# Altium schematic sheet Sheet2.SchDoc
size A4
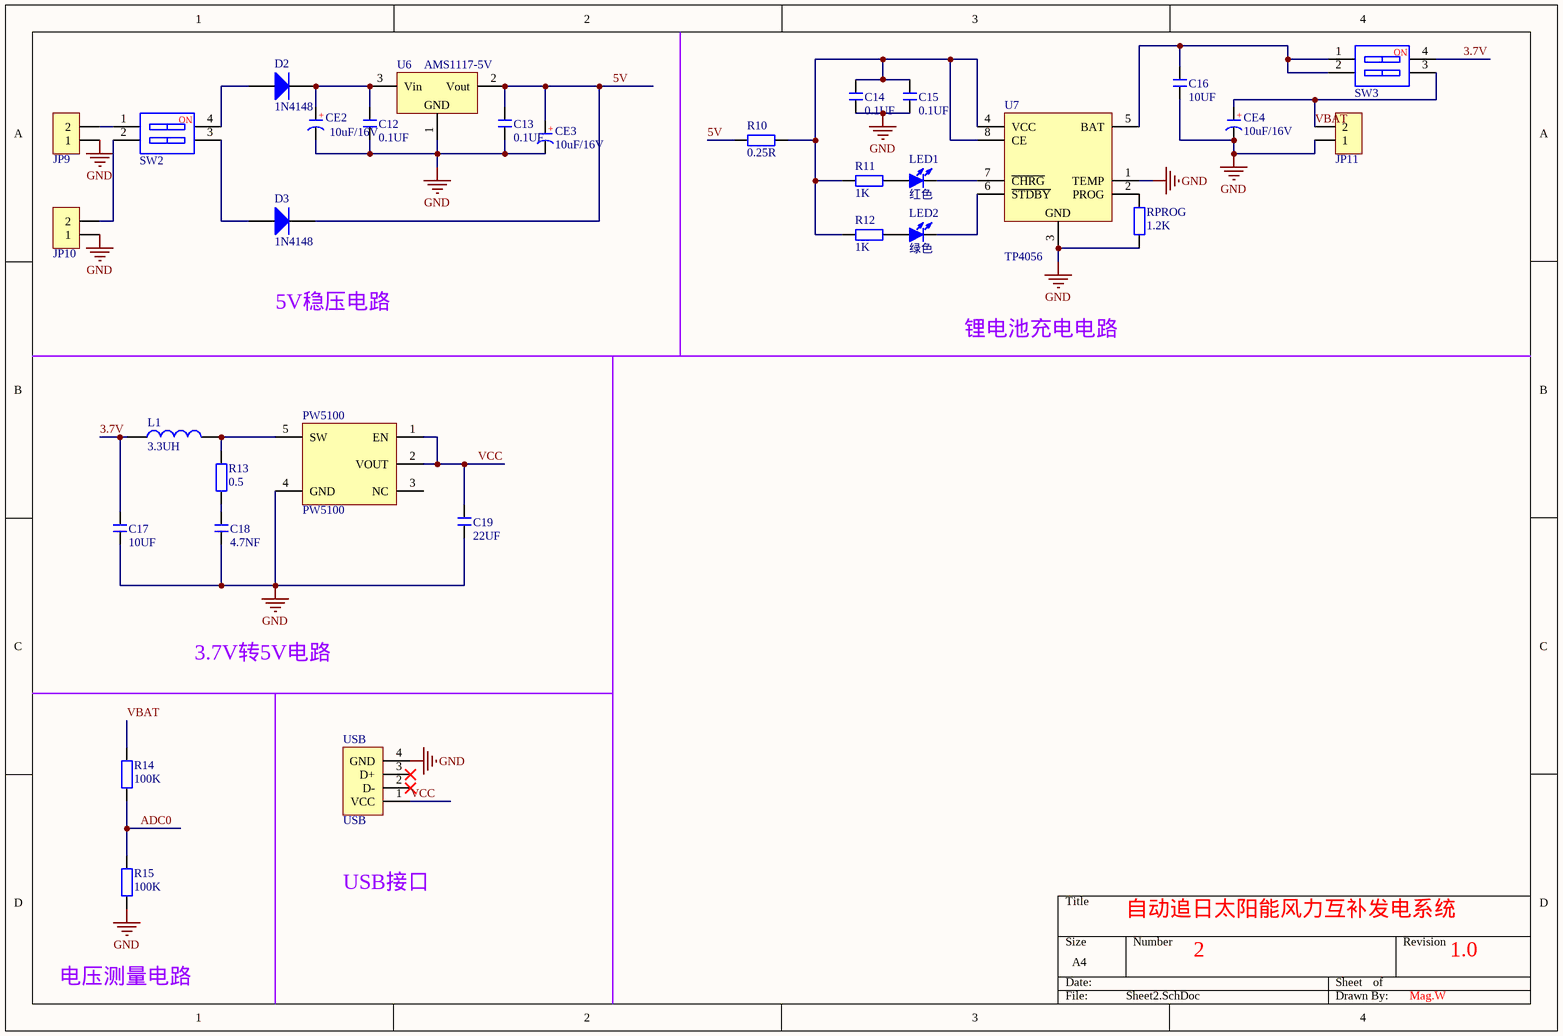
[diagram p0: Sheet2.SchDoc]

## Parts
C12  0.1UF  [C 0805_L]
C13  0.1UF  [C 0805_L]
C14  0.1UF  [C 0805_L]
C15  0.1UF  [C 0805_L]
C16  10UF  [C 0805_L]
C17  10UF  [C 0805_L]
C18  4.7NF  [C 0805_L]
C19  22UF  [C 0805_L]
CE2  10uF/16V  [CAP 1.5*4*8 - BK]
CE3  10uF/16V  [CAP 1.5*4*8 - BK]
CE4  10uF/16V  [CAP 1.5*4*8 - BK]
D2  Type: 1N4148  [DIODE-1206]  (hidden comment: Diode)
D3  Type: 1N4148  [DIODE-1206]  (hidden comment: Diode)
JP9  HDR-1X2  [KF350-2P]  (value not drawn)
JP10  HDR-1X2  [KF350-2P]  (value not drawn)
JP11  HDR-1X2  [XH2.54-WI-2P]  (value not drawn)
L1  3.3UH  [L 0805]
LED1  红色  [LED 0603R]
LED2  绿色  [LED 0603G]
PW5100  PW5100  [PCBComponent_1]
R10  0.25R  [R 0805_L]
R11  1K  [R 0805_L]
R12  1K  [R 0805_L]
R13  0.5  [R 0805_L]
R14  100K  [R 0805_L]
R15  100K  [R 0805_L]
RPROG  1.2K  [R 0805_L]
SW2  SW-2P  [CSW DIP-2P]  (value not drawn)
SW3  SW-2P  [CSW DIP-2P]  (value not drawn)
U6  AMS1117-5V  [SOT223_L]
U7  TP4056  [SO8]
USB  USB  [USB-A/S_A]

## Nets
GND: C12.2 C13.2 C14.1 C15.1 C16.1 C17.1 C18.1 C19.1 CE2.2(K) CE3.2(K) CE4.2(K) JP9.1 JP10.1 JP11.1 PW5100.4(GND) R15.1 RPROG.1 U6.1(GND) U7.1(TEMP) U7.3(GND) USB.4(GND)
3.7V: C17.2 L1.1 SW3.4
5V: C13.1 CE3.1(A) D3.2(K) R10.1 U6.2(Vout)
ADC0: R14.1 R15.2
VBAT: CE4.1(A) JP11.2 R14.2 SW3.3
VCC: C19.2 PW5100.1(EN) PW5100.2(VOUT) USB.1(VCC)
NetC12_1: C12.1 CE2.1(A) D2.2(K) U6.3(Vin)
NetC14_2: C14.2 C15.2 R10.2 R11.1 R12.1 U7.4(VCC) U7.8(CE)
NetC16_2: C16.2 SW3.1 SW3.2 U7.5(BAT)
NetC18_2: C18.2 R13.2
NetD2_1: D2.1(A) SW2.4
NetD3_1: D3.1(A) SW2.3
NetJP9_2: JP9.2 SW2.1
NetJP10_2: JP10.2 SW2.2
NetL1_2: L1.2 PW5100.5(SW) R13.1
NetLED1_1: LED1.1(A) R11.2
NetLED1_2: LED1.2(K) U7.7(~{CHRG})
NetLED2_1: LED2.1(A) R12.2
NetLED2_2: LED2.2(K) U7.6(~{STDBY})
NetRPROG_2: RPROG.2 U7.2(PROG)

Not connected (* = marked no-connect by the designer): PW5100 3(NC); USB 2(D-)* 3(D+)*

## Notes on the sheet
- 5V稳压电路
- 锂电池充电电路
- 3.7V转5V电路
- USB接口
- 自动追日太阳能风力互补发电系统
- 电压测量电路
- 2
- 1.0
- Mag.W
- (in symbol CE) +
- (in symbol SW-2P) NO

## Library data of the parts
C12-C19 = C: 贴片电容; BOM名称: 无极性贴片电容; 淘宝ID: 封装库来自淘宝 ID：黄晶宝石; 联系售后，技术支持: https://shop463601444.taobao.com; 唯一出售店铺网址: https://shop463601444.taobao.com
CE2-CE4 = CE: 直插电解电容; 淘宝ID: 封装库来自淘宝 ID：黄晶宝石; BOM名称: 直插电解电容; 联系售后: https://shop463601444.taobao.com
D2 D3 = Diode: 二极管; Published: 8-Jun-2000; LatestRevisionDate: 17-Jul-2002; LatestRevisionNote: Re-released for DXP Platform.; PackageDocument: Sep-1996; PackageReference: SMC; Publisher: Altium Limited; Code_JEDEC: DO-214-AB
JP9 JP10 = Header 2: 2P接插件; 版权归属: 封装库来自淘宝卖家 ID：黄晶宝石; BOM名称: 2P接插件; 技术支持，联系售后: https://shop463601444.taobao.com
JP11 = Header 2: 2P接插件; 版权归属: 封装库来自淘宝 ID：黄晶宝石; BOM名称: 2P接插件; 联系售后: https://shop463601444.taobao.com
L1 = L: 小功率贴片电感; 淘宝ID: 封装库来自淘宝 ID：黄晶宝石; 封装库来自淘宝卖家 ID：黄晶宝石: 其他店铺购入均为盗版，不享受售后技术支持服务，请立即申请退款; BOM名称: 小功率贴片电感; 联系售后: https://shop463601444.taobao.com
LED1 LED2 = LED-SMD: 贴片LED; 版权归属: 封装库来自淘宝 ID：黄晶宝石; BOM名称: 贴片LED; 学习资源: https://shop463601444.taobao.com
R10-R15 RPROG = R: 贴片电阻; 版权归属: 来自淘宝 ID：黄晶宝石; 封装库来自淘宝卖家 ID：黄晶宝石: 其他店铺购入均为盗版，不享受售后技术支持服务，请立即申请退款; BOM名称: 贴片电阻; 联系售后: https://shop463601444.taobao.com
SW2 SW3 = SW-2P: 2路编码开关; 淘宝ID: 黄晶宝石; BOM名称: 2路编码开关; 学习资源: https://shop463601444.taobao.com
U6 = AMS1117: 三端稳压芯片; BOM名称: 稳压芯片; 淘宝ID: 封装库来自淘宝 ID：黄晶宝石; 欢迎光临淘宝店铺: https://shop463601444.taobao.com
U7 = TP4056: 锂电池充电管理
USB = USB-A/S: USB-A型母接口; 版权归属: 封装库来自淘宝 ID：黄晶宝石; BOM名称: USB-A型母接口; 学习资源: https://shop463601444.taobao.com